# Altium project PCB_Project.PrjPCB
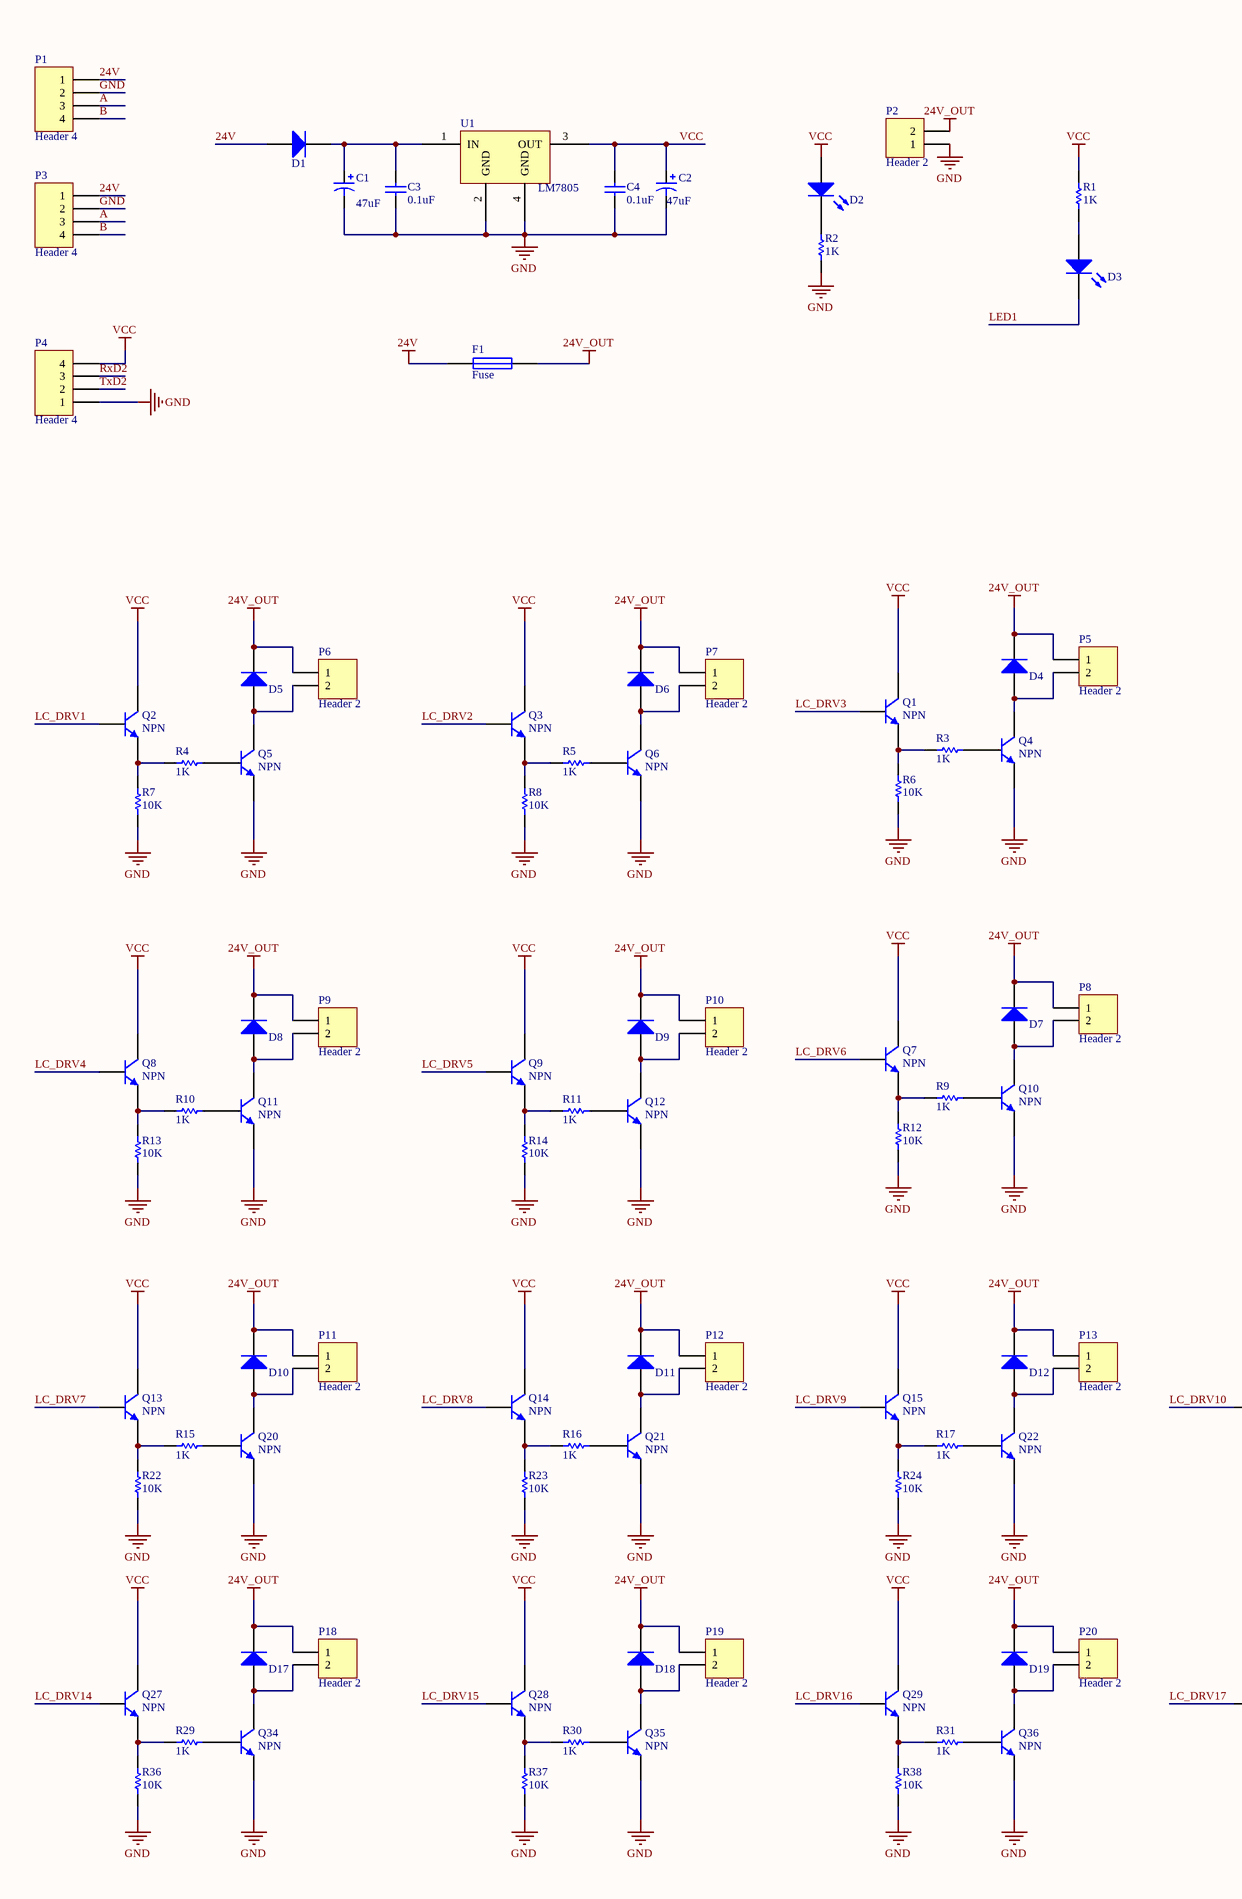
[diagram p0: lockdriver.SchDoc, left]
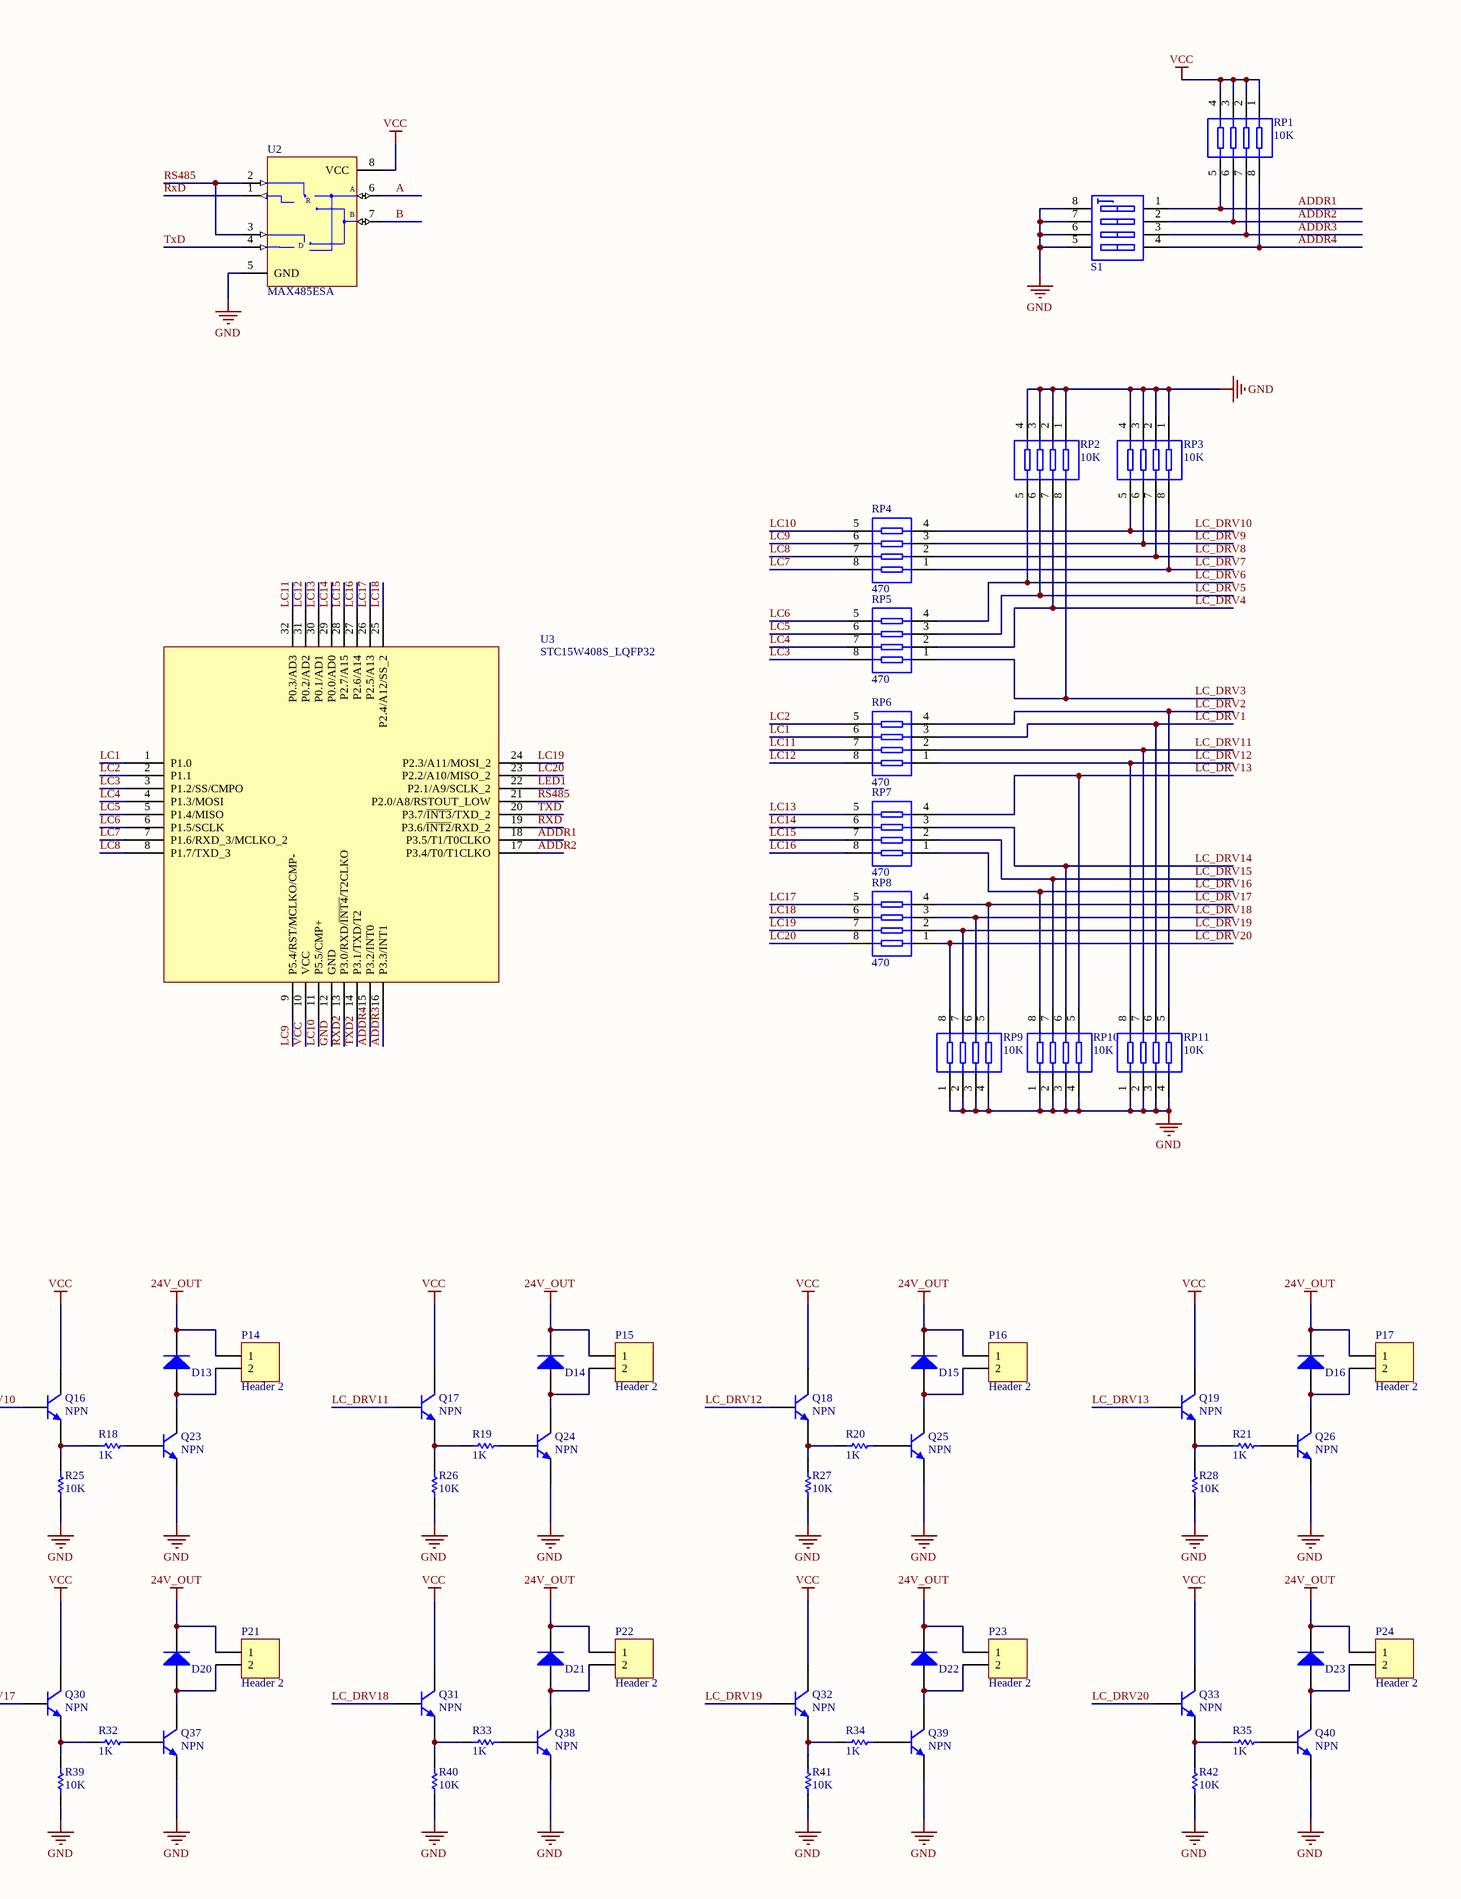
[diagram p1: lockdriver.SchDoc, right]
1 sheet, 149 parts. Net scope: global (net labels, ports and power ports of the same name join across sheets).
Board file: 前端三极管驱动.PcbDoc

## Sheet lockdriver.SchDoc
size A2

### Parts
C1  value 47uF  [CAPPR2-5x11.5]  (hidden comment: Cap Pol2)
C2  value 47uF  [CAPPR2-5x11.5]  (hidden comment: Cap Pol2)
C3  0.1uF  [CAPC2012M]
C4  0.1uF  [CAPC2012M]
D1  1N4007  [DSO-C2/X1.8]  (value not drawn)
D2  LED  [LED2012M]  (value not drawn)
D3  LED  [LED2012M]  (value not drawn)
D4  1N4007  [DSO-C2/X1.8]  (value not drawn)
D5  1N4007  [DSO-C2/X1.8]  (value not drawn)
D6  1N4007  [DSO-C2/X1.8]  (value not drawn)
D7  1N4007  [DSO-C2/X1.8]  (value not drawn)
D8  1N4007  [DSO-C2/X1.8]  (value not drawn)
D9  1N4007  [DSO-C2/X1.8]  (value not drawn)
D10  1N4007  [DSO-C2/X1.8]  (value not drawn)
D11  1N4007  [DSO-C2/X1.8]  (value not drawn)
D12  1N4007  [DSO-C2/X1.8]  (value not drawn)
D13  1N4007  [DSO-C2/X1.8]  (value not drawn)
D14  1N4007  [DSO-C2/X1.8]  (value not drawn)
D15  1N4007  [DSO-C2/X1.8]  (value not drawn)
D16  1N4007  [DSO-C2/X1.8]  (value not drawn)
D17  1N4007  [DSO-C2/X1.8]  (value not drawn)
D18  1N4007  [DSO-C2/X1.8]  (value not drawn)
D19  1N4007  [DSO-C2/X1.8]  (value not drawn)
D20  1N4007  [DSO-C2/X1.8]  (value not drawn)
D21  1N4007  [DSO-C2/X1.8]  (value not drawn)
D22  1N4007  [DSO-C2/X1.8]  (value not drawn)
D23  1N4007  [DSO-C2/X1.8]  (value not drawn)
F1  Fuse  [SR075]
P1  Header 4  [VH396-4]
P2  Header 2  [VH396-2]
P3  Header 4  [VH396-4]
P4  Header 4  [HDR1X4]
P5  Header 2  [XH254-2]
P6  Header 2  [XH254-2]
P7  Header 2  [XH254-2]
P8  Header 2  [XH254-2]
P9  Header 2  [XH254-2]
P10  Header 2  [XH254-2]
P11  Header 2  [XH254-2]
P12  Header 2  [XH254-2]
P13  Header 2  [XH254-2]
P14  Header 2  [XH254-2]
P15  Header 2  [XH254-2]
P16  Header 2  [XH254-2]
P17  Header 2  [XH254-2]
P18  Header 2  [XH254-2]
P19  Header 2  [XH254-2]
P20  Header 2  [XH254-2]
P21  Header 2  [XH254-2]
P22  Header 2  [XH254-2]
P23  Header 2  [XH254-2]
P24  Header 2  [XH254-2]
Q1  NPN  [SOT23-3M]
Q2  NPN  [SOT23-3M]
Q3  NPN  [SOT23-3M]
Q4  NPN  [SOT_32]
Q5  NPN  [SOT_32]
Q6  NPN  [SOT_32]
Q7  NPN  [SOT23-3M]
Q8  NPN  [SOT23-3M]
Q9  NPN  [SOT23-3M]
Q10  NPN  [SOT_32]
Q11  NPN  [SOT_32]
Q12  NPN  [SOT_32]
Q13  NPN  [SOT23-3M]
Q14  NPN  [SOT23-3M]
Q15  NPN  [SOT23-3M]
Q16  NPN  [SOT23-3M]
Q17  NPN  [SOT23-3M]
Q18  NPN  [SOT23-3M]
Q19  NPN  [SOT23-3M]
Q20  NPN  [SOT_32]
Q21  NPN  [SOT_32]
Q22  NPN  [SOT_32]
Q23  NPN  [SOT_32]
Q24  NPN  [SOT_32]
Q25  NPN  [SOT_32]
Q26  NPN  [SOT_32]
Q27  NPN  [SOT23-3M]
Q28  NPN  [SOT23-3M]
Q29  NPN  [SOT23-3M]
Q30  NPN  [SOT23-3M]
Q31  NPN  [SOT23-3M]
Q32  NPN  [SOT23-3M]
Q33  NPN  [SOT23-3M]
Q34  NPN  [SOT_32]
Q35  NPN  [SOT_32]
Q36  NPN  [SOT_32]
Q37  NPN  [SOT_32]
Q38  NPN  [SOT_32]
Q39  NPN  [SOT_32]
Q40  NPN  [SOT_32]
R1  1K  [RESC2012M]
R2  1K  [RESC2012M]
R3  1K  [RESC2012M]
R4  1K  [RESC2012M]
R5  1K  [RESC2012M]
R6  10K  [RESC2012M]
R7  10K  [RESC2012M]
R8  10K  [RESC2012M]
R9  1K  [RESC2012M]
R10  1K  [RESC2012M]
R11  1K  [RESC2012M]
R12  10K  [RESC2012M]
R13  10K  [RESC2012M]
R14  10K  [RESC2012M]
R15  1K  [RESC2012M]
R16  1K  [RESC2012M]
R17  1K  [RESC2012M]
R18  1K  [RESC2012M]
R19  1K  [RESC2012M]
R20  1K  [RESC2012M]
R21  1K  [RESC2012M]
R22  10K  [RESC2012M]
R23  10K  [RESC2012M]
R24  10K  [RESC2012M]
R25  10K  [RESC2012M]
R26  10K  [RESC2012M]
R27  10K  [RESC2012M]
R28  10K  [RESC2012M]
R29  1K  [RESC2012M]
R30  1K  [RESC2012M]
R31  1K  [RESC2012M]
R32  1K  [RESC2012M]
R33  1K  [RESC2012M]
R34  1K  [RESC2012M]
R35  1K  [RESC2012M]
R36  10K  [RESC2012M]
R37  10K  [RESC2012M]
R38  10K  [RESC2012M]
R39  10K  [RESC2012M]
R40  10K  [RESC2012M]
R41  10K  [RESC2012M]
R42  10K  [RESC2012M]
RP1  10K  [EXB38V]
RP2  10K  [EXB38V]
RP3  10K  [EXB38V]
RP4  470  [EXB38V]
RP5  470  [EXB38V]
RP6  470  [EXB38V]
RP7  470  [EXB38V]
RP8  470  [EXB38V]
RP9  10K  [EXB38V]
RP10  10K  [EXB38V]
RP11  10K  [EXB38V]
S1  SW DIP-4  [SWITCH-8]  (value not drawn)
U1  LM7805  [SOT223-4M]
U2  MAX485ESA  [SO8_M]
U3  STC15W408S_LQFP32  [LQFP32]

### Nets
24V: D1.1(A) F1.1 P1.1 P3.1
24V_OUT: D4.2(K) D5.2(K) D6.2(K) D7.2(K) D8.2(K) D9.2(K) D10.2(K) D11.2(K) D12.2(K) D13.2(K) D14.2(K) D15.2(K) D16.2(K) D17.2(K) D18.2(K) D19.2(K) D20.2(K) D21.2(K) D22.2(K) D23.2(K) F1.2 P2.2 P5.1 P6.1 P7.1 P8.1 P9.1 P10.1 P11.1 P12.1 P13.1 P14.1 P15.1 P16.1 P17.1 P18.1 P19.1 P20.1 P21.1 P22.1 P23.1 P24.1
GND: C1.2 C2.2 C3.1 C4.2 P1.2 P2.1 P3.2 P4.1 Q4.2(E) Q5.2(E) Q6.2(E) Q10.2(E) Q11.2(E) Q12.2(E) Q20.2(E) Q21.2(E) Q22.2(E) Q23.2(E) Q24.2(E) Q25.2(E) Q26.2(E) Q34.2(E) Q35.2(E) Q36.2(E) Q37.2(E) Q38.2(E) Q39.2(E) Q40.2(E) R2.1 R6.1 R7.1 R8.1 R12.1 R13.1 R14.1 R22.1 R23.1 R24.1 R25.1 R26.1 R27.1 R28.1 R36.1 R37.1 R38.1 R39.1 R40.1 R41.1 R42.1 RP2.1 RP2.2 RP2.3 RP2.4 RP3.1 RP3.2 RP3.3 RP3.4 RP9.1 RP9.2 RP9.3 RP9.4 RP10.1 RP10.2 RP10.3 RP10.4 RP11.1 RP11.2 RP11.3 RP11.4 S1.5(B4) S1.6(B3) S1.7(B2) S1.8(B1) U1.2(GND) U1.4(GND) U2.5(GND) U3.12(GND)
VCC: C2.1 C4.1 D2.1(A) P4.4 Q1.3(C) Q2.3(C) Q3.3(C) Q7.3(C) Q8.3(C) Q9.3(C) Q13.3(C) Q14.3(C) Q15.3(C) Q16.3(C) Q17.3(C) Q18.3(C) Q19.3(C) Q27.3(C) Q28.3(C) Q29.3(C) Q30.3(C) Q31.3(C) Q32.3(C) Q33.3(C) R1.2 RP1.1 RP1.2 RP1.3 RP1.4 U1.3(OUT) U2.8(VCC) U3.10(VCC)
A: P1.3 P3.3 U2.6(A)
ADDR1: RP1.5 S1.1(A1) U3.18(P3.5/T1/T0CLKO)
ADDR2: RP1.6 S1.2(A2) U3.17(P3.4/T0/T1CLKO)
ADDR3: RP1.7 S1.3(A3) U3.16(P3.3/INT1)
ADDR4: RP1.8 S1.4(A4) U3.15(P3.2/INT0)
B: P1.4 P3.4 U2.7(B)
LC1: RP6.6 U3.1(P1.0)
LC2: RP6.5 U3.2(P1.1)
LC3: RP5.8 U3.3(P1.2/SS/CMPO)
LC4: RP5.7 U3.4(P1.3/MOSI)
LC5: RP5.6 U3.5(P1.4/MISO)
LC6: RP5.5 U3.6(P1.5/SCLK)
LC7: RP4.8 U3.7(P1.6/RXD_3/MCLKO_2)
LC8: RP4.7 U3.8(P1.7/TXD_3)
LC9: RP4.6 U3.9(P5.4/RST/MCLKO/CMP-)
LC10: RP4.5 U3.11(P5.5/CMP+)
LC11: RP6.7 U3.32(P0.3/AD3)
LC12: RP6.8 U3.31(P0.2/AD2)
LC13: RP7.5 U3.30(P0.1/AD1)
LC14: RP7.6 U3.29(P0.0/AD0)
LC15: RP7.7 U3.28(P2.7/A15)
LC16: RP7.8 U3.27(P2.6/A14)
LC17: RP8.5 U3.26(P2.5/A13)
LC18: RP8.6 U3.25(P2.4/A12/SS_2)
LC19: RP8.7 U3.24(P2.3/A11/MOSI_2)
LC20: RP8.8 U3.23(P2.2/A10/MISO_2)
LC_DRV1: Q2.1(B) RP6.3 RP11.6
LC_DRV2: Q3.1(B) RP6.4 RP11.5
LC_DRV3: Q1.1(B) RP2.8 RP5.1
LC_DRV4: Q8.1(B) RP2.7 RP5.2
LC_DRV5: Q9.1(B) RP2.6 RP5.3
LC_DRV6: Q7.1(B) RP2.5 RP5.4
LC_DRV7: Q13.1(B) RP3.8 RP4.1
LC_DRV8: Q14.1(B) RP3.7 RP4.2
LC_DRV9: Q15.1(B) RP3.6 RP4.3
LC_DRV10: Q16.1(B) RP3.5 RP4.4
LC_DRV11: Q17.1(B) RP6.2 RP11.7
LC_DRV12: Q18.1(B) RP6.1 RP11.8
LC_DRV13: Q19.1(B) RP7.4 RP10.5
LC_DRV14: Q27.1(B) RP7.3 RP10.6
LC_DRV15: Q28.1(B) RP7.2 RP10.7
LC_DRV16: Q29.1(B) RP7.1 RP10.8
LC_DRV17: Q30.1(B) RP8.4 RP9.5
LC_DRV18: Q31.1(B) RP8.3 RP9.6
LC_DRV19: Q32.1(B) RP8.2 RP9.7
LC_DRV20: Q33.1(B) RP8.1 RP9.8
LED1: D3.2(K) U3.22(P2.1/A9/SCLK_2)
RS485: U2.2(~{RE}) U2.3(DE) U3.21(P2.0/A8/RSTOUT_LOW)
RxD: U2.1(RO) U3.19(P3.6/~{INT2}/RXD_2)
RxD2: P4.3 U3.13(P3.0/RXD/~{INT4}/T2CLKO)
TxD: U2.4(DI) U3.20(P3.7/~{INT3}/TXD_2)
TxD2: P4.2 U3.14(P3.1/TXD/T2)
NetC1_1: C1.1 C3.2 D1.2(K) U1.1(IN)
NetD2_2: D2.2(K) R2.2
NetD3_1: D3.1(A) R1.1
NetD4_1: D4.1(A) P5.2 Q4.3(C)
NetD5_1: D5.1(A) P6.2 Q5.3(C)
NetD6_1: D6.1(A) P7.2 Q6.3(C)
NetD7_1: D7.1(A) P8.2 Q10.3(C)
NetD8_1: D8.1(A) P9.2 Q11.3(C)
NetD9_1: D9.1(A) P10.2 Q12.3(C)
NetD10_1: D10.1(A) P11.2 Q20.3(C)
NetD11_1: D11.1(A) P12.2 Q21.3(C)
NetD12_1: D12.1(A) P13.2 Q22.3(C)
NetD13_1: D13.1(A) P14.2 Q23.3(C)
NetD14_1: D14.1(A) P15.2 Q24.3(C)
NetD15_1: D15.1(A) P16.2 Q25.3(C)
NetD16_1: D16.1(A) P17.2 Q26.3(C)
NetD17_1: D17.1(A) P18.2 Q34.3(C)
NetD18_1: D18.1(A) P19.2 Q35.3(C)
NetD19_1: D19.1(A) P20.2 Q36.3(C)
NetD20_1: D20.1(A) P21.2 Q37.3(C)
NetD21_1: D21.1(A) P22.2 Q38.3(C)
NetD22_1: D22.1(A) P23.2 Q39.3(C)
NetD23_1: D23.1(A) P24.2 Q40.3(C)
NetQ1_2: Q1.2(E) R3.1 R6.2
NetQ2_2: Q2.2(E) R4.1 R7.2
NetQ3_2: Q3.2(E) R5.1 R8.2
NetQ4_1: Q4.1(B) R3.2
NetQ5_1: Q5.1(B) R4.2
NetQ6_1: Q6.1(B) R5.2
NetQ7_2: Q7.2(E) R9.1 R12.2
NetQ8_2: Q8.2(E) R10.1 R13.2
NetQ9_2: Q9.2(E) R11.1 R14.2
NetQ10_1: Q10.1(B) R9.2
NetQ11_1: Q11.1(B) R10.2
NetQ12_1: Q12.1(B) R11.2
NetQ13_2: Q13.2(E) R15.1 R22.2
NetQ14_2: Q14.2(E) R16.1 R23.2
NetQ15_2: Q15.2(E) R17.1 R24.2
NetQ16_2: Q16.2(E) R18.1 R25.2
NetQ17_2: Q17.2(E) R19.1 R26.2
NetQ18_2: Q18.2(E) R20.1 R27.2
NetQ19_2: Q19.2(E) R21.1 R28.2
NetQ20_1: Q20.1(B) R15.2
NetQ21_1: Q21.1(B) R16.2
NetQ22_1: Q22.1(B) R17.2
NetQ23_1: Q23.1(B) R18.2
NetQ24_1: Q24.1(B) R19.2
NetQ25_1: Q25.1(B) R20.2
NetQ26_1: Q26.1(B) R21.2
NetQ27_2: Q27.2(E) R29.1 R36.2
NetQ28_2: Q28.2(E) R30.1 R37.2
NetQ29_2: Q29.2(E) R31.1 R38.2
NetQ30_2: Q30.2(E) R32.1 R39.2
NetQ31_2: Q31.2(E) R33.1 R40.2
NetQ32_2: Q32.2(E) R34.1 R41.2
NetQ33_2: Q33.2(E) R35.1 R42.2
NetQ34_1: Q34.1(B) R29.2
NetQ35_1: Q35.1(B) R30.2
NetQ36_1: Q36.1(B) R31.2
NetQ37_1: Q37.1(B) R32.2
NetQ38_1: Q38.1(B) R33.2
NetQ39_1: Q39.1(B) R34.2
NetQ40_1: Q40.1(B) R35.2

### Notes on the sheet
- (in symbol MAX485ESA) R; D

### Library data of the parts
C1 C2 = Cap Pol2: Polarized Capacitor (22uf-47uf); Published: 8-Jun-2000; LatestRevisionDate: 17-Jul-2002; LatestRevisionNote: Re-released for DXP Platform.; Publisher: Altium Limited; PackageDescription: Polarized Capacitor; 2 Leads
C3 C4 = Cap: Capacitor; Published: 8-Jun-2000; LatestRevisionDate: 17-Jul-2002; LatestRevisionNote: Re-released for DXP Platform.; PackageReference: RAD-0.3; Publisher: Altium Limited; PackageDescription: Radial Cap, Thru-Hole; 2 Leads; 0.3 in Pin Spacing; Value: 0.1uF
D1 D4-D23 = Diode: Default Diode; Published: 8-Jun-2000; LatestRevisionDate: 17-Jul-2002; LatestRevisionNote: Re-released for DXP Platform.; PackageVersion: Sep-1996; PackageReference: SMC; Publisher: Altium Limited; PackageDescription: DO-214-AB/SMC; 2 C-Bend Leads; Body 7.9 x 5.9 mm, inc. leads (LxW); Code_JEDEC: DO-214-AB; Value: 1N4007
D2 D3 = LED: Typical INFRARED GaAs LED; Published: 8-Jun-2000; LatestRevisionDate: 08-Jul-2005; LatestRevisionNote: Mech Layer 1 removed.; PackageReference: LED-0; Publisher: Altium Limited; PackageDescription: LED; 2 Leads
P1 P3 P4 = Header 4: Header, 4-Pin; LatestRevisionDate: 17-Jul-2002; LatestRevisionNote: Re-released for DXP Platform.; Publisher: Altium Limited
P2 P5-P24 = Header 2: Header, 2-Pin; LatestRevisionDate: 17-Jul-2002; LatestRevisionNote: Re-released for DXP Platform.; Publisher: Altium Limited
Q1-Q40 = NPN: NPN Bipolar Transistor; Published: 8-Jun-2000; LatestRevisionDate: 17-Jul-2002; LatestRevisionNote: Re-released for DXP Platform.; PackageReference: TO-226-AA; Publisher: Altium Limited; PackageDescription: TO, Flat Index; 3 In-Line, Axial Leads; Body Dia. 4.8mm; Leads 0.55 x 0.51 mm (max); Code_JEDEC: TO-226-AA
R1-R42 = Res: Resistor; Published: 8-Jun-2000; LatestRevisionDate: 17-Jul-2002; LatestRevisionNote: Re-released for DXP Platform.; PackageReference: AXIAL-0.3; Publisher: Altium Limited; PackageDescription: Axial Device, Thru-Hole; 2 Leads; 0.3 in Pin Spacing
  R1-R5 R9-R11 R15-R21 R29-R35: Value: 1K
  R6-R8 R12-R14 R22-R28 R36-R42: Value: 10K
RP1-RP11 = Res Pack
  RP1-RP3 RP9-RP11: Value: 10K
  RP4-RP8: Value: 470
S1 = SW DIP-4: DIP Switch, 4 Position, SPST; Published: 24-Mar-1999; LatestRevisionDate: 29-May-2009; LatestRevisionNote: IPC-7351 Footprint Added.; PackageVersion: Dec-2002; PackageReference: SO8; Publisher: Altium Limited; PackageDescription: 8-Pin Small Outline Integrated Circuit 1.27 mm Pitch; Code_JEDEC: MS-012-AA; Code_IPC: SOIC127P600-8
U2 = MAX485ESA: Low-Power, Slew-Rate-Limited RS-485/RS-422 Transceiver; Published: 16-Jan-2001; LatestRevisionDate: 13-Apr-2006; LatestRevisionNote: IPC-7351 Footprint Added.; DatasheetVersion: Feb-1996; PackageReference: NSO8; Publisher: Altium Limited; PackageDescription: 8-Pin Small Outline Integrated Circuit 1.27 mm Pitch; Code_JEDEC: MS-012-AA; Code_IPC: SOIC127P600-8; ComponentLink1Description: Manufacturer Link; ComponentLink1URL: http://www.maxim-ic.com/; ComponentLink2Description: Datasheet; ComponentLink2URL: http://pdfserv.maxim-ic.com/en/ds/MAX1487-MAX491.pdf
F1 = Fuse: Published: 8-Jun-2000; LatestRevisionDate: 17-Jul-2002; LatestRevisionNote: Re-released for DXP Platform.; PackageReference: PIN-W2/E2.8; Publisher: Altium Limited; PackageDescription: Thru-Hole; 2 Leads